# EAGLE design test (EAGLE 9.3.0)
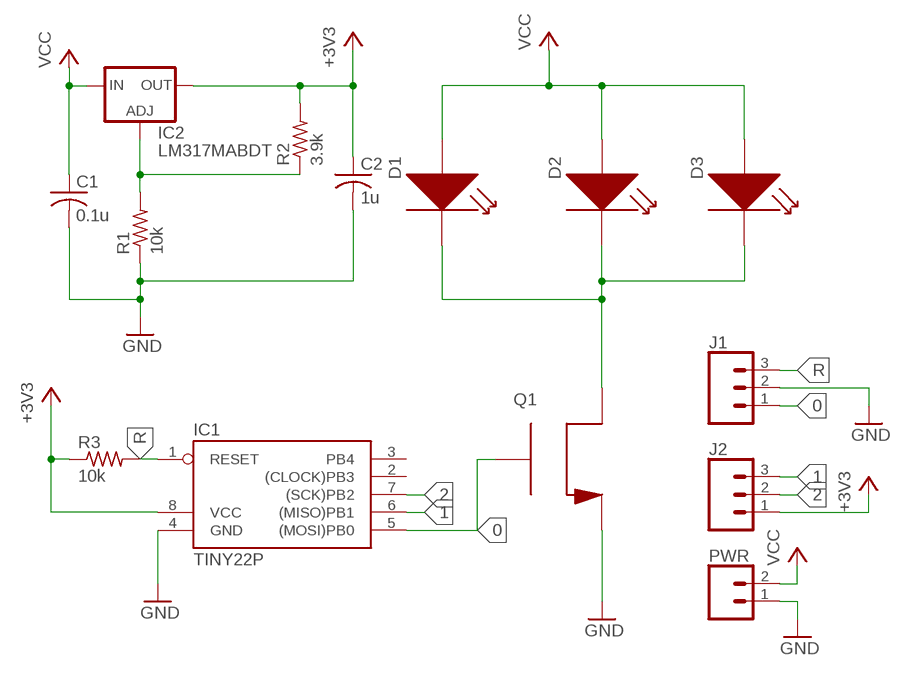
[diagram p0: schematic, sheet 1]

## Parts
C1  0.1u  C-US025-024X044  [C025-024X044]
C2  1u  C-US025-024X044  [C025-024X044]
D1  NVSLE21AT  [NVSLE21AT]
D2  NVSLE21AT  [NVSLE21AT]
D3  NVSLE21AT  [NVSLE21AT]
IC1  TINY22P  [DIL08]
IC2  LM317MABDT  [DPACK]
J1  CONN_03  [1X03]
J2  CONN_03  [1X03]
PWR  CONN_02  [1X02]
Q1  SIA436DJ  [POWERPAK_SC70-6L]
R1  10k  R-US_0204/5  [0204/5]
R2  3.9k  R-US_0204/5  [0204/5]
R3  10k  R-US_0204/5  [0204/5]

## Nets
0: IC1.5((MOSI)PB0) J1.1 Q1.P$4(G)
1: IC1.6((MISO)PB1) J2.3
2: IC1.7((SCK)PB2) J2.2
+3V3: C2.1 IC1.8(VCC) IC2.4(OUT) J2.1 R2.2 R3.1
GND: C1.2 C2.2 IC1.4(GND) J1.2 PWR.1 Q1.P$2(S) Q1.P$3(S) R1.1
N$1: D1.P$1(CATHODE) D2.P$1(CATHODE) D3.P$1(CATHODE) Q1.P$1(D) Q1.P$5(D) Q1.P$6(D) Q1.P$7(D) Q1.P$8(D)
N$2: IC2.1(ADJ) R1.2 R2.1
R: IC1.1(RESET) J1.3 R3.2
VCC: C1.1 D1.P$2(ANODE) D2.P$2(ANODE) D3.P$2(ANODE) IC2.3(IN) PWR.2
Unconnected: IC1.2((CLOCK)PB3) IC1.3(PB4)

## Library data of the parts
C1 C2 = resistor:C-US: CAPACITOR, American symbol
D1-D3 = leds:NVSLE21AT
IC1 = atmel:TINY22: MICROCONTROLLER 1K ROM 128 bytes RAM 128 bytes EEPROM; OC_FARNELL: unknown; OC_NEWARK: unknown
IC2 = v-reg:LM317?*: 500 mA Adjustable Output Positive Voltage Regulator Source: http://www.onsemi.co.jp .. LM317M-D.PDF
J1 J2 = SparkFun-Connectors:CONN_03: Multi connection point. Often used as Generic Header-pin footprint for 0.1 inch spaced/style header connections On any of the 0.1 inch spaced packages, you can populate with these: Break Away Headers - Straight <https://www.sparkfun.com/products/116> (PRT-00116) Break Away Male Headers - Right Angle <https://www.sparkfun.com/products/553> (PRT-00553) Female Headers <https://www.sparkfun.com/products/115> (PRT-00115) Break Away Headers - Machine Pin <https://www.sparkfun.com/products/117> (PRT-00117) Break Away Female Headers - Swiss Machine Pin <https://www.sparkfun.com/products/743> (PRT-00743) Stackable Header - 3 Pin (Female, 0.1") <https://www.sparkfun.com/products/13875> (PRT-13875) For SCREWTERMINALS and SPRING TERMINALS visit here: Screw Terimnals on SparkFun.com <https://www.sparkfun.com/search/results?term=Screw+Terminals> (5mm/3.5mm/2.54mm spacing) This device is also useful as a general connection point to wire up your design to another part of your project. Our various solder wires solder well into these plated through hole pads. Hook-Up Wire - Assortment (Stranded, 22 AWG) <https://www.sparkfun.com/products/11375> (PRT-11375) Hook-Up Wire - Assortment (Solid Core, 22 AWG) <https://www.sparkfun.com/products/11367> (PRT-11367) View the entire wire category on our website here <https://www.sparkfun.com/categories/141> Special notes: Molex polarized connector foot print use with SKU : PRT-08232 with associated crimp pins and housings.
PWR = SparkFun-Connectors:CONN_02: Multi connection point. Often used as Generic Header-pin footprint for 0.1 inch spaced/style header connections On any of the 0.1 inch spaced packages, you can populate with these: Break Away Headers - Straight <https://www.sparkfun.com/products/116> (PRT-00116) Break Away Male Headers - Right Angle <https://www.sparkfun.com/products/553> (PRT-00553) Female Headers <https://www.sparkfun.com/products/115> (PRT-00115) Break Away Headers - Machine Pin <https://www.sparkfun.com/products/117> (PRT-00117) Break Away Female Headers - Swiss Machine Pin <https://www.sparkfun.com/products/743> (PRT-00743) For SCREWTERMINALS and SPRING TERMINALS visit here: Screw Terimnals on SparkFun.com <https://www.sparkfun.com/search/results?term=Screw+Terminals> (5mm/3.5mm/2.54mm spacing) This device is also useful as a general connection point to wire up your design to another part of your project. Our various solder wires solder well into these plated through hole pads. Hook-Up Wire - Assortment (Stranded, 22 AWG) <https://www.sparkfun.com/products/11375> (PRT-11375) Hook-Up Wire - Assortment (Solid Core, 22 AWG) <https://www.sparkfun.com/products/11367> (PRT-11367) View the entire wire category on our website here <https://www.sparkfun.com/categories/141> Special notes: Molex polarized connector foot print use with: PRT-08233 with associated crimp pins and housings. 2.54_SCREWTERM for use with PRT-10571. 3.5mm Screw Terminal footprints for PRT-08084 5mm Screw Terminal footprints for use with PRT-08432
Q1 = transistors:SIA436DJ
R1-R3 = resistor:R-US_: RESISTOR, American symbol

## Board
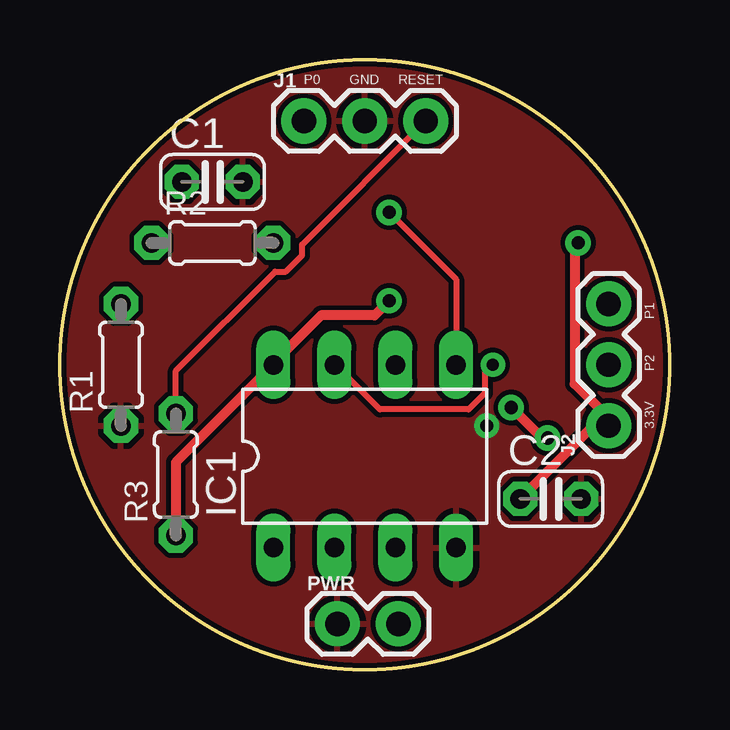
[diagram p1: board, top side]
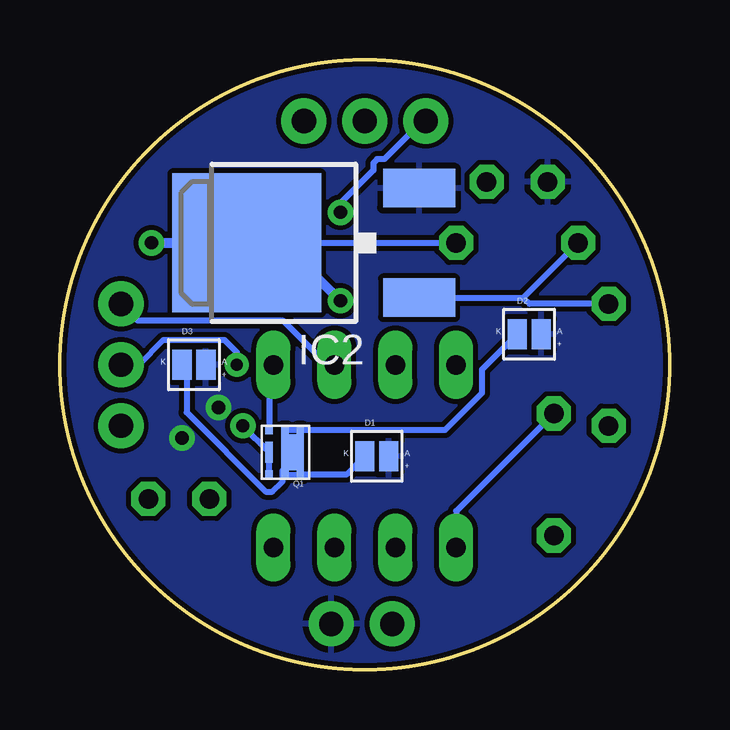
[diagram p2: board, bottom side, seen from below]

Size 25.4 x 25.4 mm. Coordinates in mm from the lower left corner, seen from the top.
Outline: circle at 12.7,12.7 radius 12.7
Copper layers (1*16): Top 0.035mm / dielectric 1.5mm / Bottom 0.035mm
Design rules "SparkFun": minimum track width 8mil, minimum drill 20mil, track to track 8mil, track to pad 8mil, pad to pad 8mil, via to via 8mil, smd to smd 8mil, copper to edge 8mil, drill to drill 8mil, minimum pad ring 12mil, minimum via ring 10mil, stop-mask expansion 4mil, vias tented up to drill 20mil, thermal gap 10mil

### Footprints (pad centres in the part's own frame; a part is rotated, then mirrored left to right if it is on the bottom)
C025-024X044 = drill 0.813 octagon: 1 -1.27,0; 2 1.27,0
NVSLE21AT = smd 0.8 x 1.26: P$1 0,0; P$2 1.001,0
DIL08 = drill 0.813 long: 1 -3.81,-3.81; 2 -1.27,-3.81; 3 1.27,-3.81; 4 3.81,-3.81; 5 3.81,3.81; 6 1.27,3.81; 7 -1.27,3.81; 8 -3.81,3.81
DPACK = smd 1.6 x 3: 1 -2.28,-4.8; 3 2.28,-4.8 | smd 5.8 x 6.2: 4 0,2.38
1X03 = drill 1.016 pad 1.88: 1 0,0; 2 2.54,0; 3 5.08,0
1X02 = drill 1.016 pad 1.88: 1 0,0; 2 2.54,0
POWERPAK_SC70-6L = smd 0.94 x 1.499: P$1 0.47,1.105 | smd 0.305 x 0.356: P$2 1.448,2.032; P$4 1.448,0.178; P$5 0.152,2.032; P$6 0.787,2.032; P$7 0.152,0.178; P$8 0.787,0.178 | smd 0.305 x 0.864: P$3 1.448,1.105
0204/5 = drill 0.813 octagon: 1 -2.54,0; 2 2.54,0

### Placement (x,y rotation side)
C1  6.35,20.32 0 top
C2  20.45,7.11 0 top
D1  12.7,8.89 0 bottom
D2  6.35,13.97 0 bottom
D3  20.32,12.7 0 bottom
IC1  12.7,8.89 0 top
IC2  15.24,17.78 90 bottom
J1  10.16,22.86 0 top
J2  22.86,10.16 90 top
PWR  11.56,1.9 0 top
Q1  15.24,10.16 180 bottom
R1  2.54,12.7 90 top
R2  6.35,17.78 0 top
R3  4.83,8.13 90 top

### Tracks (layer width: path | path; a pad name or v marks a point on that pad's centre or on a via)
0  (via drill 0.55)
  Top 0.254: v13.72,19.05 16.51,16.26 IC1.5
  Bottom 0.254: IC1.5 16.69,12.52 Q1.P$4 | J1.1 10.29,22.86 11.88,21.27 12.18,21.27 12.35,21.1 12.35,20.8 13.72,19.43 v13.72,19.05
1
  Bottom 0.254: IC1.6 14.27,12.7 16.12,14.55 22.17,14.55 J2.3
2  (via drill 0.51)
  Top 0.254: v18.03,12.7 17.7,12.37 17.7,11.52 17.03,10.85 13.33,10.85 11.47,12.7 IC1.7
  Bottom 0.254: J2.2 22.13,12.7 21.09,13.74 18.55,13.74 18.03,13.22 v18.03,12.7
+3V3  (via drill 0.55)
  Top 0.406: v13.72,15.37 13.11,14.76 10.88,14.76 8.89,12.76 IC1.8 4.83,8.64 R3.1 | C2.1 22.23,10.16 J2.1 22.86,10.49 21.44,11.91 21.44,17.63 v21.59,17.78
  Bottom 0.254: IC2.4 R2.2
  Bottom 0.406: v13.72,15.37 16.13,17.78 IC2.4 v21.59,17.78
GND  (via drill 0.55)
  Bottom 0.254: v17.78,10.16 17.78,10.15 Q1.P$3 Q1.P$2
  pour Top: -2.54,-1.27 29.21,-1.27 29.21,26.67 -2.54,26.67
N$1
  Bottom 0.254: D1.P$1 13.46,8.13 Q1.P$5 Q1.P$6 16.03,8.41 | D2.P$1 7.82,12.5 7.82,11.52 9.36,9.98 Q1.P$7 | D3.P$1 20.13,12.51 20.13,10.71 16.83,7.42 16.55,7.42 16.13,7.83 16.13,8.31 16.03,8.41 | Q1.P$7 Q1.P$8 | 16.03,8.41 16.03,8.74 Q1.P$1 15.39,9.37 Q1.P$7
N$2
  Bottom 0.254: IC2.1 6.09,15.5 | 6.09,15.5 R2.1 | R1.2 5.83,15.24 6.09,15.5
R
  Top 0.254: R3.2 4.83,12.45 8.97,16.59 9.41,16.59 10.08,17.26 10.08,17.7 J1.3
  Bottom 0.254: R3.2 8.89,6.6 IC1.1
VCC  (via drill 0.55)
  Top 0.406: v20.32,9.65 20.07,9.65 v18.8,10.92
  pour Bottom: -5.08,27.94 31.75,27.94 31.75,-2.54 -5.08,-2.54

### Text on the board
tPlace: P0 | GND | RESET | P1 | P2 | 3.3V